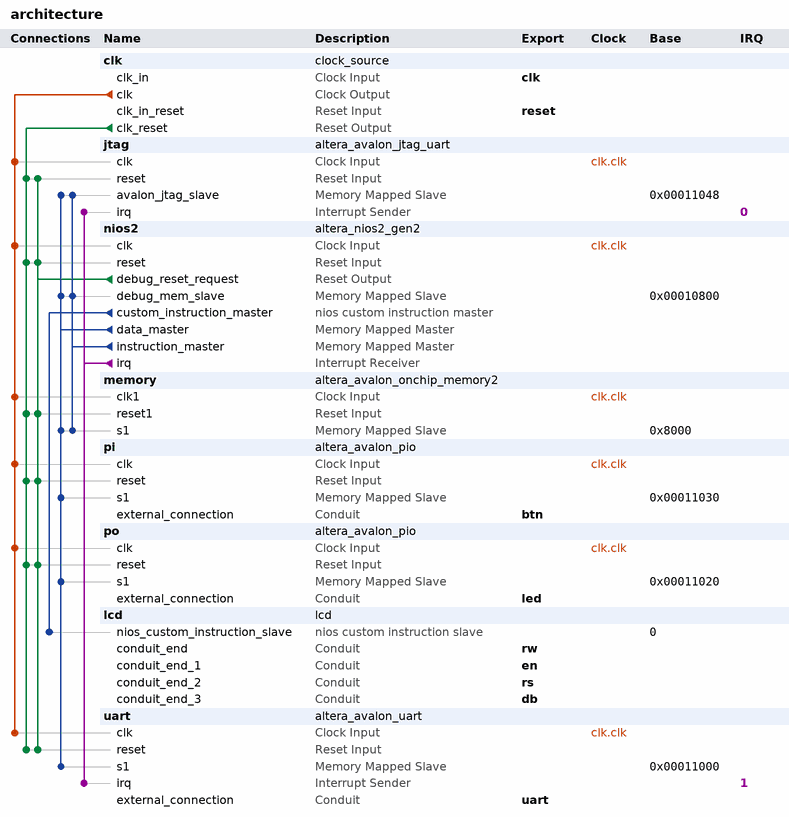
[diagram p0: system contents]
# Platform Designer (Qsys) system architecture, Cyclone IV E EP4CE6E22C8
# Parameters at their usual value, and those the tool derives, are not listed.
package require -exact qsys 18.1
create_system architecture
set_project_property DEVICE_FAMILY {Cyclone IV E}
set_project_property DEVICE EP4CE6E22C8

add_instance clk clock_source 18.1
set_instance_parameter_value clk clockFrequency 50000000

add_instance jtag altera_avalon_jtag_uart 18.1
set_instance_parameter_value jtag simInteractiveOptions NO_INTERACTIVE_WINDOWS

add_instance nios2 altera_nios2_gen2 18.1
set_instance_parameter_value nios2 dcache_size 2048
set_instance_parameter_value nios2 exceptionSlave memory.s1
set_instance_parameter_value nios2 icache_size 4096
set_instance_parameter_value nios2 impl Tiny
set_instance_parameter_value nios2 resetSlave memory.s1

add_instance memory altera_avalon_onchip_memory2 18.1
set_instance_parameter_value memory dataWidth 32
set_instance_parameter_value memory dualPort false
set_instance_parameter_value memory initMemContent true
set_instance_parameter_value memory initializationFileName onchip_mem.hex
set_instance_parameter_value memory memorySize 24576

add_instance pi altera_avalon_pio 18.1
set_instance_parameter_value pi direction Input
set_instance_parameter_value pi width 4

add_instance po altera_avalon_pio 18.1
set_instance_parameter_value po direction Output
set_instance_parameter_value po width 4

add_instance lcd lcd 1.0

add_instance uart altera_avalon_uart 18.1
set_instance_parameter_value uart baud 115200
set_instance_parameter_value uart dataBits 8
set_instance_parameter_value uart fixedBaud true
set_instance_parameter_value uart parity NONE
set_instance_parameter_value uart stopBits 1

# connections
add_connection clk.clk jtag.clk clock
add_connection clk.clk memory.clk1 clock
add_connection clk.clk nios2.clk clock
add_connection clk.clk pi.clk clock
add_connection clk.clk po.clk clock
add_connection clk.clk uart.clk clock
add_connection clk.clk_reset jtag.reset reset
add_connection clk.clk_reset memory.reset1 reset
add_connection clk.clk_reset nios2.reset reset
add_connection clk.clk_reset pi.reset reset
add_connection clk.clk_reset po.reset reset
add_connection clk.clk_reset uart.reset reset
add_connection nios2.debug_reset_request jtag.reset reset
add_connection nios2.debug_reset_request memory.reset1 reset
add_connection nios2.debug_reset_request nios2.reset reset
add_connection nios2.debug_reset_request pi.reset reset
add_connection nios2.debug_reset_request po.reset reset
add_connection nios2.debug_reset_request uart.reset reset
add_connection nios2.data_master jtag.avalon_jtag_slave avalon
set_connection_parameter_value nios2.data_master/jtag.avalon_jtag_slave baseAddress 0x00011048
add_connection nios2.data_master memory.s1 avalon
set_connection_parameter_value nios2.data_master/memory.s1 baseAddress 0x8000
add_connection nios2.data_master nios2.debug_mem_slave avalon
set_connection_parameter_value nios2.data_master/nios2.debug_mem_slave baseAddress 0x00010800
add_connection nios2.data_master pi.s1 avalon
set_connection_parameter_value nios2.data_master/pi.s1 baseAddress 0x00011030
add_connection nios2.data_master po.s1 avalon
set_connection_parameter_value nios2.data_master/po.s1 baseAddress 0x00011020
add_connection nios2.data_master uart.s1 avalon
set_connection_parameter_value nios2.data_master/uart.s1 baseAddress 0x00011000
add_connection nios2.instruction_master jtag.avalon_jtag_slave avalon
set_connection_parameter_value nios2.instruction_master/jtag.avalon_jtag_slave baseAddress 0x00011048
add_connection nios2.instruction_master memory.s1 avalon
set_connection_parameter_value nios2.instruction_master/memory.s1 baseAddress 0x8000
add_connection nios2.instruction_master nios2.debug_mem_slave avalon
set_connection_parameter_value nios2.instruction_master/nios2.debug_mem_slave baseAddress 0x00010800
add_connection nios2.irq jtag.irq interrupt
set_connection_parameter_value nios2.irq/jtag.irq irqNumber 0
add_connection nios2.irq uart.irq interrupt
set_connection_parameter_value nios2.irq/uart.irq irqNumber 1
add_connection nios2.custom_instruction_master lcd.nios_custom_instruction_slave nios_custom_instruction
set_connection_parameter_value nios2.custom_instruction_master/lcd.nios_custom_instruction_slave CIName lcd
set_connection_parameter_value nios2.custom_instruction_master/lcd.nios_custom_instruction_slave baseAddress 0

# exported interfaces
add_interface btn conduit end
set_interface_property btn EXPORT_OF pi.external_connection
add_interface clk clock sink
set_interface_property clk EXPORT_OF clk.clk_in
add_interface db conduit end
set_interface_property db EXPORT_OF lcd.conduit_end_3
add_interface en conduit end
set_interface_property en EXPORT_OF lcd.conduit_end_1
add_interface led conduit end
set_interface_property led EXPORT_OF po.external_connection
add_interface reset reset sink
set_interface_property reset EXPORT_OF clk.clk_in_reset
add_interface rs conduit end
set_interface_property rs EXPORT_OF lcd.conduit_end_2
add_interface rw conduit end
set_interface_property rw EXPORT_OF lcd.conduit_end
add_interface uart conduit end
set_interface_property uart EXPORT_OF uart.external_connection

set_interconnect_requirement {$system} qsys_mm.clockCrossingAdapter HANDSHAKE
set_interconnect_requirement {$system} qsys_mm.enableEccProtection FALSE
set_interconnect_requirement {$system} qsys_mm.insertDefaultSlave FALSE
set_interconnect_requirement {$system} qsys_mm.maxAdditionalLatency 1

save_system architecture.qsys
